# EAGLE design Linefollower_ArduinoNano (EAGLE 9.3.1)
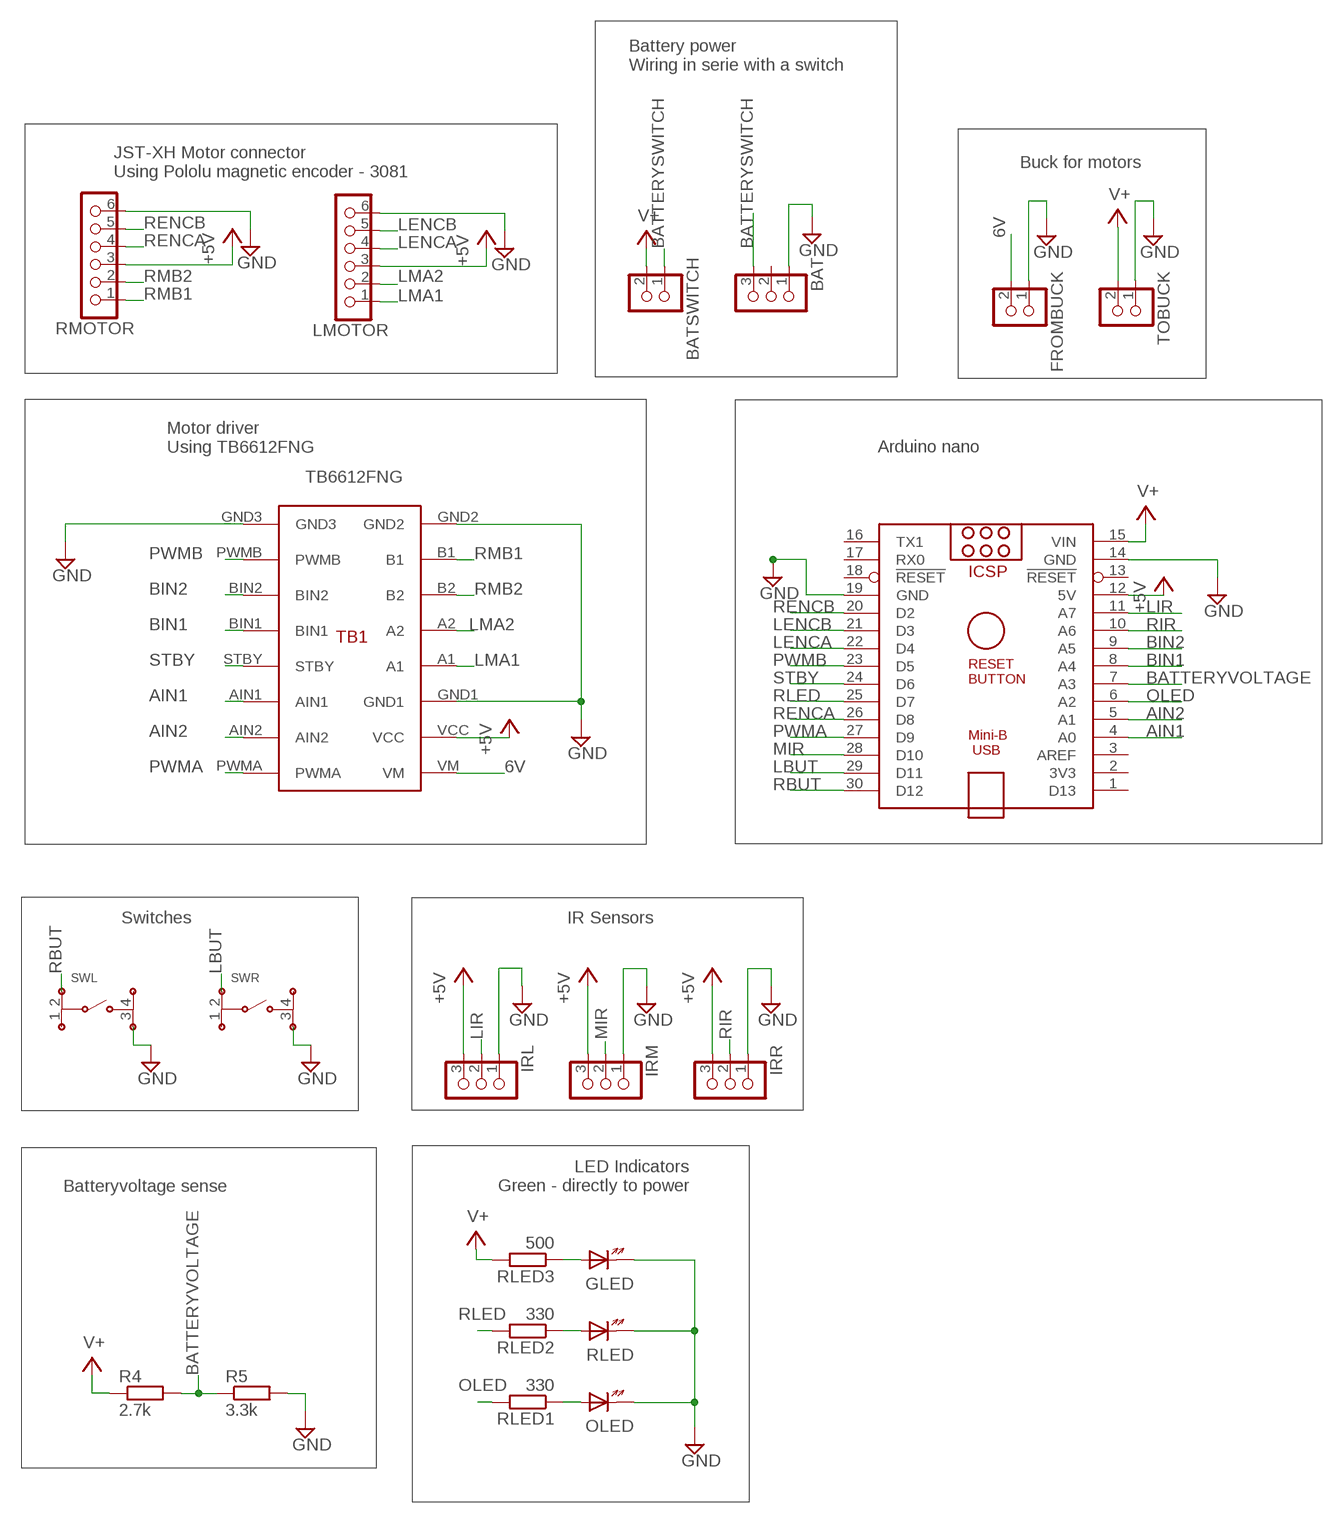
[diagram p0: schematic, sheet 1]

## Parts
ARDUINO_NANO1  ARDUINO_NANO  [ARDUINO_NANO]
BAT  EH_B3B-EH  [B3B-EH]
BATSWITCH  EH_B2B-EH  [B2B-EH]
FROMBUCK  EH_B2B-EH  [B2B-EH]
GLED  LED5MM  [LED5MM]
IRL  EH_B3B-EH  [B3B-EH]
IRM  EH_B3B-EH  [B3B-EH]
IRR  EH_B3B-EH  [B3B-EH]
LMOTOR  EH_B6B-EH  [B6B-EH]
OLED  LED5MM  [LED5MM]
R4  2.7k  R0603  [R0603]
R5  3.3k  R0603  [R0603]
RLED  LED5MM  [LED5MM]
RLED1  330  R0603  [R0603]
RLED2  330  R0603  [R0603]
RLED3  500  R0603  [R0603]
RMOTOR  EH_B6B-EH  [B6B-EH]
SWL  SKHHA/D  [SKHHA/D]
SWR  SKHHA/D  [SKHHA/D]
TB1  TB6612FNG  [TB6612FNG]
TOBUCK  EH_B2B-EH  [B2B-EH]

## Nets
6V [motorPower]: FROMBUCK.2 TB1.VM
+5V [motorPower]: ARDUINO_NANO1.12(5V) IRL.3 IRM.3 IRR.3 LMOTOR.3 RMOTOR.3 TB1.VCC
AIN1: ARDUINO_NANO1.4(A0) TB1.AIN1
AIN2: ARDUINO_NANO1.5(A1) TB1.AIN2
BATTERYSWITCH [motorPower]: BAT.3 BATSWITCH.1
BATTERYVOLTAGE: ARDUINO_NANO1.7(A3) R4.2 R5.1
BIN1: ARDUINO_NANO1.8(A4) TB1.BIN1
BIN2: ARDUINO_NANO1.9(A5) TB1.BIN2
GND [motorPower]: ARDUINO_NANO1.14(GND) ARDUINO_NANO1.19(GND) BAT.1 FROMBUCK.1 GLED.K IRL.1 IRM.1 IRR.1 LMOTOR.6 OLED.K R5.2 RLED.K RMOTOR.6 SWL.3 SWR.3 TB1.GND1 TB1.GND2 TB1.GND3 TOBUCK.1
LBUT: ARDUINO_NANO1.29(D11) SWR.2
LENCA: ARDUINO_NANO1.22(D4) LMOTOR.4
LENCB: ARDUINO_NANO1.21(D3) LMOTOR.5
LIR: ARDUINO_NANO1.11(A7) IRL.2
LMA1 [motorPower]: LMOTOR.1 TB1.A1
LMA2: LMOTOR.2 TB1.A2
MIR: ARDUINO_NANO1.28(D10) IRM.2
N$1: GLED.A RLED3.1
N$2: RLED2.1 RLED.A
N$3: OLED.A RLED1.1
OLED: ARDUINO_NANO1.6(A2) RLED1.2
PWMA: ARDUINO_NANO1.27(D9) TB1.PWMA
PWMB: ARDUINO_NANO1.23(D5) TB1.PWMB
RBUT: ARDUINO_NANO1.30(D12) SWL.2
RENCA: ARDUINO_NANO1.26(D8) RMOTOR.4
RENCB: ARDUINO_NANO1.20(D2) RMOTOR.5
RIR: ARDUINO_NANO1.10(A6) IRR.2
RLED: ARDUINO_NANO1.25(D7) RLED2.2
RMB1 [motorPower]: RMOTOR.1 TB1.B1
RMB2 [motorPower]: RMOTOR.2 TB1.B2
STBY: ARDUINO_NANO1.24(D6) TB1.STBY
V+ [motorPower]: ARDUINO_NANO1.15(VIN) BATSWITCH.2 R4.1 RLED3.2 TOBUCK.2
Unconnected: ARDUINO_NANO1.1(D13) ARDUINO_NANO1.2(3V3) ARDUINO_NANO1.3(AREF) ARDUINO_NANO1.13(!RESET) ARDUINO_NANO1.16(TX1) ARDUINO_NANO1.17(RX0) ARDUINO_NANO1.18(!RESET) BAT.2 SWL.1 SWL.4 SWR.1 SWR.4

## Notes on the sheet
- Battery power
  Wiring in serie with a switch
- Buck for motors
- JST-XH Motor connector
  Using Pololu magnetic encoder - 3081
- Motor driver
  Using TB6612FNG
- Arduino nano
- Switches | IR Sensors
- LED Indicators
  Green - directly to power
- Batteryvoltage sense

## Library data of the parts
ARDUINO_NANO1 = ArduinoNanoV30:ARDUINO_NANO: Arduino Nano V3.0 Overview: The Arduino Nano is a small, complete, and breadboard-friendly board based on the ATmega328 (Arduino Nano 3.x) or ATmega168 (Arduino Nano 2.x). It has more or less the same functionality of the Arduino Duemilanove, but in a different package. It lacks only a DC power jack, and works with a Mini-B USB cable instead of a standard one. The Nano was designed and is being produced by Gravitech. Specifications: Microcontroller Atmel ATmega168 or ATmega328 Operating Voltage (logic level) 5 V Input Voltage (recommended) 7-12 V Input Voltage (limits) 6-20 V Digital I/O Pins 14 (of which 6 provide PWM output) Analog Input Pins 8 DC Current per I/O Pin 40 mA Flash Memory 16 KB (ATmega168) or 32 KB (ATmega328) of which 2 KB used by bootloader SRAM 1 KB (ATmega168) or 2 KB (ATmega328) EEPROM 512 bytes (ATmega168) or 1 KB (ATmega328) Clock Speed 16 MHz Dimensions 0.73" x 1.70" Length 45 mm Width 18 mm Weigth 5 g Power: The Arduino Nano can be powered via the Mini-B USB connection, 6-20V unregulated external power supply (pin 30), or 5V regulated external power supply (pin 27). The power source is automatically selected to the highest voltage source. Memory: The ATmega168 has 16 KB of flash memory for storing code (of which 2 KB is used for the bootloader); the ATmega328 has 32 KB, (also with 2 KB used for the bootloader). The ATmega168 has 1 KB of SRAM and 512 bytes of EEPROM (which can be read and written with the EEPROM library); the ATmega328 has 2 KB of SRAM and 1 KB of EEPROM. Input and Output: Each of the 14 digital pins on the Nano can be used as an input or output, using pinMode(), digitalWrite(), and digitalRead() functions. They operate at 5 volts. Each pin can provide or receive a maximum of 40 mA and has an internal pull-up resistor (disconnected by default) of 20-50 kOhms. In addition, some pins have specialized functions. Visit Arduino - ArduinoBoardNano <https://www.arduino.cc/en/Main/ArduinoBoardNano>
BAT IRL IRM IRR = CASE-JST:EH_B3B-EH: JST EH Connector, through hole, 3 pin, top entry Description: JST EH connector with 2.5 mm pitch, through hole version, 3 pin, top entry. Links: Datasheet <http://www.jst-mfg.com/product/pdf/eng/eEH.pdf>
BATSWITCH FROMBUCK TOBUCK = CASE-JST:EH_B2B-EH: JST EH Connector, through hole, 2 pin, top entry Description: JST EH connector with 2.5 mm pitch, through hole version, 2 pin, top entry. Links: Datasheet <http://www.jst-mfg.com/product/pdf/eng/eEH.pdf>
GLED OLED RLED = CASE-LED:LED5MM: LED 5mm (TH) Description: Standard 5mm TH LED
LMOTOR RMOTOR = CASE-JST:EH_B6B-EH: JST EH Connector, through hole, 6 pin, top entry Description: JST EH connector with 2.5 mm pitch, through hole version, 6 pin, top entry. Links: Datasheet <http://www.jst-mfg.com/product/pdf/eng/eEH.pdf>
R4 R5 RLED1-RLED3 = CASE-RCL:R0603: Standard Chip RESISTOR 0603 (1608 Metric) Description: Standard Chip RESISTOR 0603 (1608 Metric)
SWL SWR = CASE-Switches:SKHHA/D: ALPS SKHHA/D Tactile SPST switches (DIP) Description: ALPS SKHHA/D Tactile SPST switches in DIP package. Links: SKHHAJA010 <http://www.farnell.com/datasheets/1685516.pdf?_ga=2.249631877.2071720333.1546461288-1112771566.1525371275> SKHHARA010 <http://www.farnell.com/datasheets/1685516.pdf?_ga=2.249631877.2071720333.1546461288-1112771566.1525371275> SKHHAPA010 <http://www.farnell.com/datasheets/1582298.pdf?_ga=2.236523650.2071720333.1546461288-1112771566.1525371275> SKHHDUA010 <http://www.farnell.com/datasheets/1582310.pdf?_ga=2.236523650.2071720333.1546461288-1112771566.1525371275>
TB1 = TB6612FNG:TB6612FNG

## Net classes
0 default: width 0.254 mm
1 motorPower: width 0.889 mm, clearance 0.254 mm

## Board
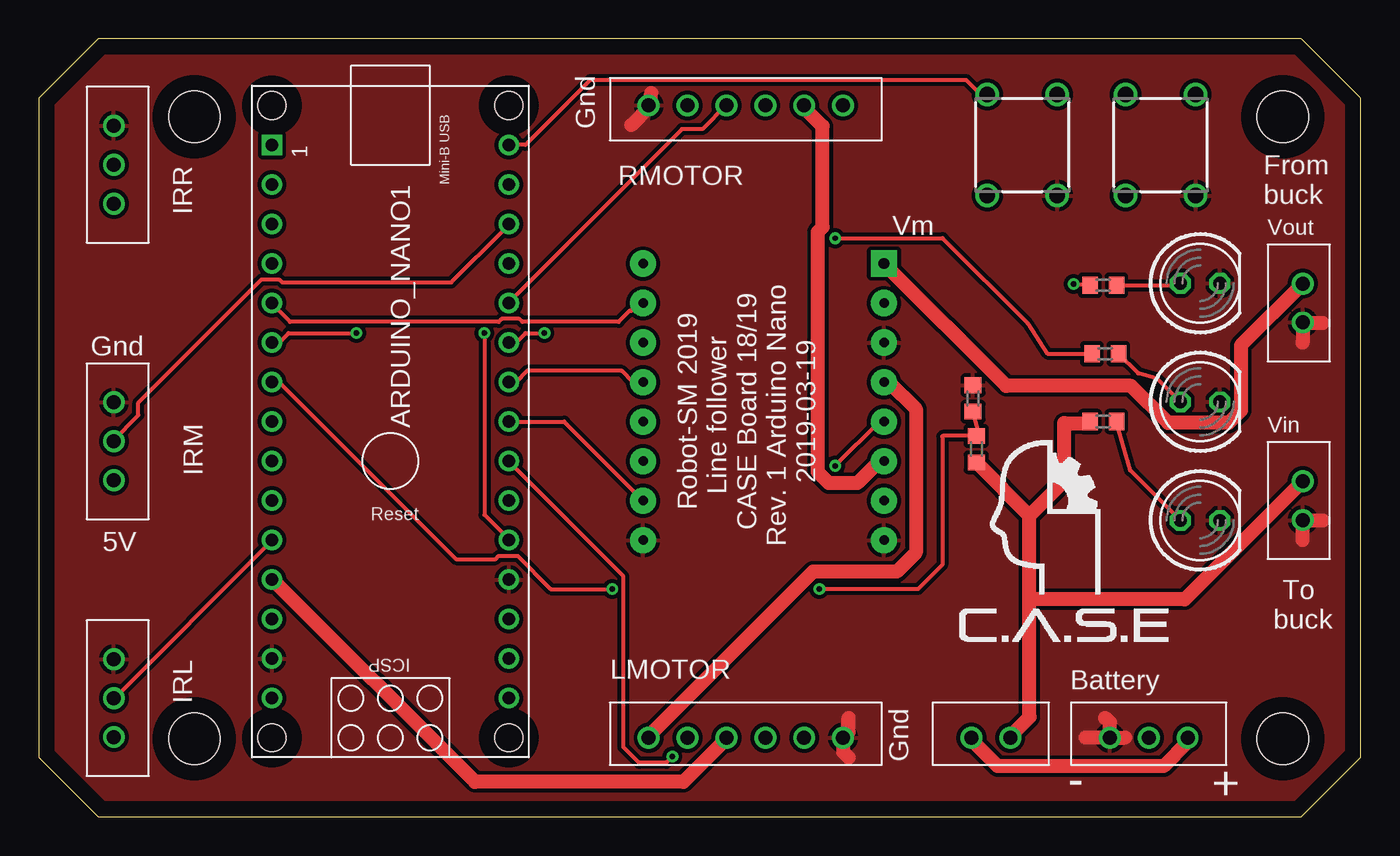
[diagram p1: board, top side]
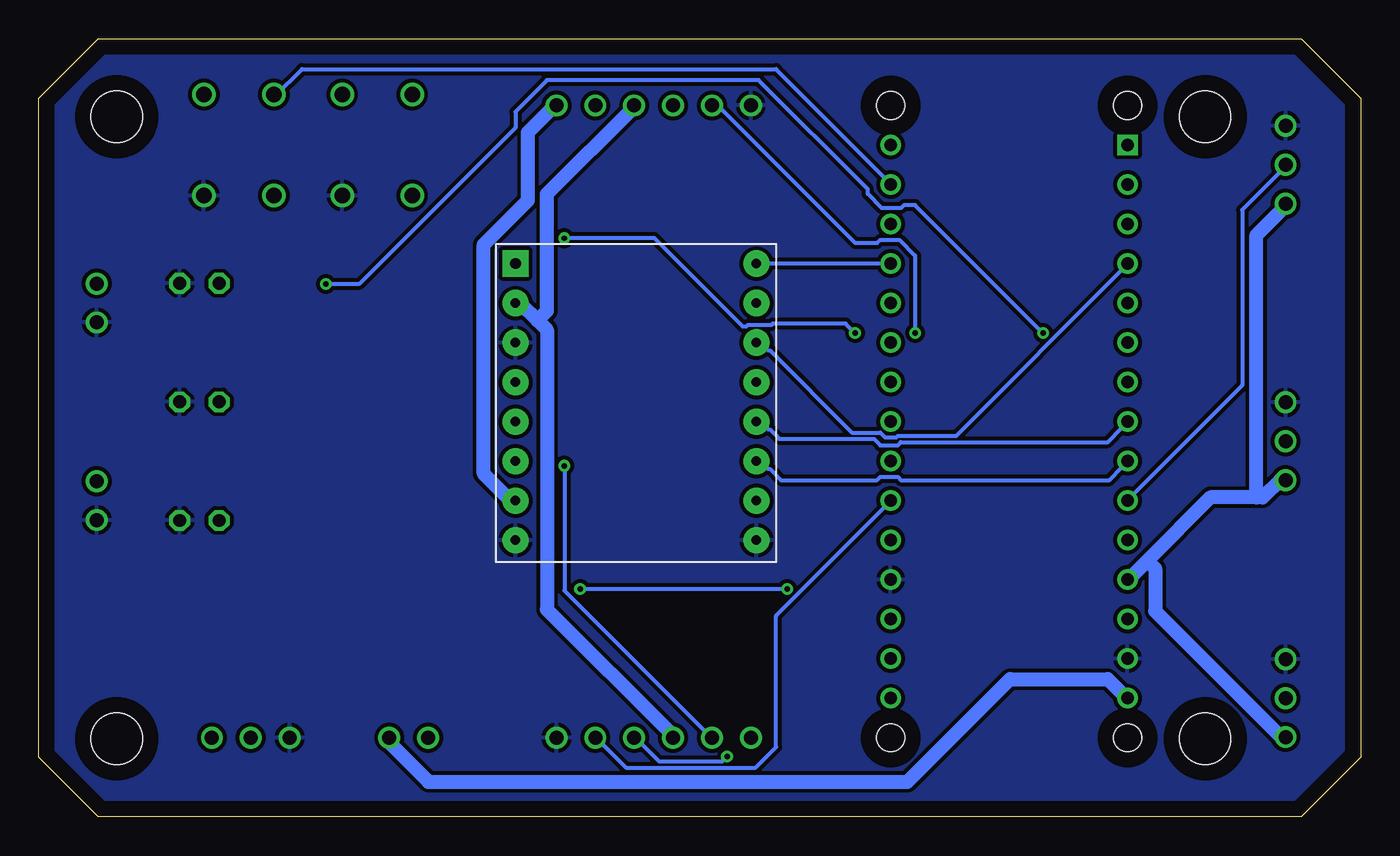
[diagram p2: board, bottom side, seen from below]

Size 85 x 50 mm. Coordinates in mm from the lower left corner, seen from the top.
Outline: 3.81,0 81.19,0 85,3.81 85,46.19 81.19,50 3.81,50 0,46.19 0,3.81 3.81,0
Copper layers (1*16): Top 0.035mm / dielectric 1.5mm / Bottom 0.035mm
Design rules "default": minimum track width 6mil, minimum drill 0.35mm, track to track 6mil, track to pad 6mil, pad to pad 6mil, via to via 6mil, smd to smd 6mil, copper to edge 40mil, drill to drill 6mil, minimum pad ring 10mil, minimum via ring 8mil, stop-mask expansion 4mil, vias tented up to drill 0mil, thermal gap 10mil
Holes 3.3 mm at 10,5 80,45 10,45 80,5

### Footprints (pad centres in the part's own frame; a part is rotated, then mirrored left to right if it is on the bottom)
ARDUINO_NANO = drill 0.8 square: 1 -20.32,-7.62 | drill 0.8: 2 -17.78,-7.62; 3 -15.24,-7.62; 4 -12.7,-7.62; 5 -10.16,-7.62; 6 -7.62,-7.62; 7 -5.08,-7.62; 8 -2.54,-7.62; 9 0,-7.62; 10 2.54,-7.62; 11 5.08,-7.62; 12 7.62,-7.62; 13 10.16,-7.62; 14 12.7,-7.62; 15 15.24,-7.62; 16 15.24,7.62; 17 12.7,7.62; 18 10.16,7.62; 19 7.62,7.62; 20 5.08,7.62; 21 2.54,7.62; 22 0,7.62; 23 -2.54,7.62; 24 -5.08,7.62; 25 -7.62,7.62; 26 -10.16,7.62; 27 -12.7,7.62; 28 -15.24,7.62; 29 -17.78,7.62; 30 -20.32,7.62 | hole 1.778: -22.86,-7.62; -22.86,7.62; 17.78,7.62; 17.78,-7.62
B3B-EH = drill 0.9: 1 -2.5,0; 2 0,0; 3 2.5,0
B2B-EH = drill 0.9: 1 -1.25,0; 2 1.25,0
LED5MM = drill 0.813 octagon: A -1.27,0; K 1.27,0
B6B-EH = drill 0.9: 1 -6.25,0; 2 -3.75,0; 3 -1.25,0; 4 1.25,0; 5 3.75,0; 6 6.25,0
R0603 = smd 1 x 1.1: 1 -0.85,0; 2 0.85,0
SKHHA/D = drill 1 pad 1.5: 1 -2.25,-3.25; 2 -2.25,3.25; 3 2.25,-3.25; 4 2.25,3.25
TB6612FNG = drill 0.6 pad 1.676: A1 -7.62,-1.27; A2 -7.62,-3.81; AIN1 7.874,1.27; AIN2 7.874,3.81; B1 -7.62,-8.89; B2 -7.62,-6.35; BIN1 7.874,-3.81; BIN2 7.874,-6.35; GND1 -7.62,1.27; GND2 -7.62,-11.43; GND3 7.874,-11.43; PWMA 7.874,6.35; PWMB 7.874,-8.89; STBY 7.874,-1.27; VCC -7.62,3.81 | drill 0.7 pad 1.676 square: VM -7.62,6.35

### Placement (x,y rotation side)
ARDUINO_NANO1  22.61,22.86 270 top
BAT  71.37,5.08 0 top
BATSWITCH  61.21,5.08 0 top
FROMBUCK  81.28,33.02 90 top
GLED  74.68,19.05 0 top
IRL  4.83,7.62 270 top
IRM  4.83,24.13 270 top
IRR  4.83,41.91 270 top
LMOTOR  45.47,5.08 0 top
OLED  74.68,34.29 0 top
R4  60.28,23.62 90 top
R5  60.07,26.88 90 top
RLED  74.68,26.67 0 top
RLED1  68.45,34.16 180 top
RLED2  68.58,29.76 180 top
RLED3  68.45,25.4 180 top
RMOTOR  45.47,45.72 180 top
SWL  63.25,43.18 0 top
SWR  72.14,43.18 0 top
TB1  46.74,29.21 0 bottom
TOBUCK  81.28,20.32 90 top

### Tracks (layer width: path | path; a pad name or v marks a point on that pad's centre or on a via)
6V
  Top 0.889: FROMBUCK.2 77.31,30.3 77.31,26.11 76.51,25.31 72.62,25.31 70.24,27.7 62.22,27.7 TB1.VM
+5V
  Top 0.889: ARDUINO_NANO1.12 15.04,15.24 28.04,2.23 41.45,2.23 44.3,5.08 LMOTOR.3
  Bottom 0.889: 13.72,16.46 9.65,20.52 6.71,20.52 | 13.72,16.46 14.94,15.24 ARDUINO_NANO1.12 | 6.71,20.52 6.3,20.52 5.18,21.64 4.88,21.64 IRM.3 | IRL.3 4.88,5.18 5.18,5.18 13.21,13.21 13.21,15.95 13.72,16.46 | 6.71,20.52 6.71,37.39 4.88,39.22 4.88,39.32 IRR.3 | 52.93,31.9 54.05,33.02 TB1.VCC | 52.93,31.9 52.32,31.29 52.32,13.31 44.3,5.28 44.3,5.08 LMOTOR.3 | RMOTOR.3 46.74,45.72 46.74,45.62 52.32,40.03 52.32,32.51 52.93,31.9
AIN1
  Bottom 0.254: TB1.AIN1 38.61,30.48 38.1,29.97 38,29.97 32.72,24.69 30.89,24.69 30.58,24.38 29.87,24.38 29.77,24.49 26.01,24.49 15.34,35.15 15.34,35.26 15.04,35.56 ARDUINO_NANO1.4
AIN2
  Top 0.254: TB1.AIN2 38.61,33.02 38.1,32.51 38,32.51 37.29,31.8 31.09,31.8 30.89,32 29.77,32 29.57,31.8 16.15,31.8 15.34,32.61 15.34,32.72 15.04,33.02 ARDUINO_NANO1.5
BATTERYSWITCH
  Top 0.889: BATSWITCH.1 60.05,5.08 60.05,4.88 61.67,3.25 72.34,3.25 73.86,4.78 BAT.3
BATTERYVOLTAGE  (via drill 0.35)
  Top 0.254: R5.1 60.39,24.91 R4.2 58.13,24.47 58.09,24.43 58.09,16.18 56.54,14.63 v50.19,14.63 | v36.88,14.63 32.92,14.63 30.79,16.76 29.57,16.76 29.36,16.56 26.82,16.56 15.44,27.94 ARDUINO_NANO1.7
  Bottom 0.254: v36.88,14.63 v50.19,14.63
BIN1
  Bottom 0.254: TB1.BIN1 38.61,25.4 38.1,24.89 38,24.89 37.39,24.28 31.29,24.28 30.89,23.88 29.77,23.88 29.57,24.08 16.26,24.08 15.34,24.99 15.34,25.09 15.04,25.4 ARDUINO_NANO1.8
BIN2
  Bottom 0.254: TB1.BIN2 38.61,22.86 38.1,22.35 38,22.35 37.29,21.64 31.09,21.64 30.89,21.84 29.77,21.84 29.57,21.64 16.15,21.64 15.34,22.45 15.34,22.55 15.04,22.86 ARDUINO_NANO1.9
GND
  Top 0.889: 81.28,17.78 TOBUCK.1 81.3,19.05 82.55,19.05 | 81.28,30.48 FROMBUCK.1 81.3,31.75 82.55,31.75 | BAT.1 68.87,6.06 68.58,6.35 | BAT.1 67.31,5.08 | BAT.1 69.85,5.08 | 52.07,6.35 52.07,5.43 LMOTOR.6 51.72,4.16 52.07,3.81 | 38.1,44.45 39.22,45.57 RMOTOR.6 39.37,45.87 39.37,46.52
  pour Top: -2.54,50.8 -2.54,0 1.27,-3.81 82.55,-3.81 88.9,2.54 88.9,46.99 83.82,52.07 81.28,52.07
  pour Bottom: -3.81,0 -3.81,53.34 73.12,60.23 88.9,44.45 88.9,2.54 82.55,-3.81 0,-3.81
LBUT
  Bottom 0.254: ARDUINO_NANO1.29 30.28,40.64 30.58,40.95 30.58,41.05 37.59,48.06 68.07,48.06 69.8,46.33 SWR.2
LENCA  (via drill 0.35)
  Top 0.254: v40.74,3.86 40.34,3.45 38.61,3.45 37.59,4.47 37.59,15.44 30.58,22.45 30.58,22.55 30.28,22.86 ARDUINO_NANO1.22
  Bottom 0.254: v40.74,3.86 41.05,3.56 45.11,3.56 46.63,5.08 LMOTOR.4
LENCB
  Bottom 0.254: ARDUINO_NANO1.21 30.28,20.32 30.58,20.02 30.58,19.91 37.59,12.9 37.59,4.47 38.91,3.15 47.24,3.15 49.17,5.08 LMOTOR.5
LIR
  Top 0.254: ARDUINO_NANO1.11 14.94,17.78 14.63,17.48 14.63,17.37 4.88,7.62 IRL.2
LMA1
  Top 0.889: TB1.A1 54.66,27.94 56.39,26.21 56.39,16.97 55.17,15.75 49.78,15.75 39.22,5.18 LMOTOR.1
LMA2  (via drill 0.35)
  Top 0.254: v51.21,22.55 54.05,25.4 TB1.A2
  Bottom 0.254: v51.21,22.55 51.21,14.53 41.76,5.08 LMOTOR.2
MIR
  Top 0.254: ARDUINO_NANO1.28 30.18,38.1 29.87,37.8 29.87,37.69 26.52,34.34 15.65,34.34 15.44,34.54 14.33,34.54 6.4,26.62 6.4,25.81 4.78,24.18 IRM.2
N$1
  Top 0.254: GLED.A 70.19,22.27 RLED3.1
N$2
  Top 0.254: RLED.A 71.93,28.14 70.7,28.49 RLED2.1
N$3
  Top 0.254: RLED1.1 69.39,34.14 73.41,34.14 OLED.A
OLED  (via drill 0.35)
  Top 0.254: v66.55,34.24 67.56,34.24 RLED1.2 | v20.42,31.09 16.05,31.09 15.44,30.48 ARDUINO_NANO1.6
  Bottom 0.254: v66.55,34.24 64.41,34.24 54.36,44.3 54.36,45.31 52.32,47.35 38.71,47.35 31.7,40.34 31.7,40.03 30.79,39.12 29.57,39.12 29.36,39.32 28.65,39.32 v20.42,31.09
PWMA
  Bottom 0.254: ARDUINO_NANO1.27 TB1.PWMA
PWMB
  Top 0.254: ARDUINO_NANO1.23 33.78,25.4 TB1.PWMB
RBUT
  Top 0.254: ARDUINO_NANO1.30 31.29,43.18 35.46,47.35 59.64,47.35 60.55,46.43 60.96,46.43 SWL.2
RENCA
  Top 0.254: ARDUINO_NANO1.26 30.28,33.02 30.58,33.33 30.58,33.43 41.35,44.2 42.67,44.2 44.2,45.72 RMOTOR.4
RENCB  (via drill 0.35)
  Top 0.254: v28.65,31.09 28.65,19.41 29.87,18.19 29.87,18.09 30.18,17.78 ARDUINO_NANO1.20
  Bottom 0.254: v28.65,31.09 28.65,36.07 29.67,37.08 30.89,37.08 31.09,36.88 32.51,36.88 41.35,45.72 RMOTOR.5
RIR
  Bottom 0.254: ARDUINO_NANO1.10 14.94,20.32 14.63,20.62 14.63,20.73 7.62,27.74 7.62,39.01 4.78,41.86 IRR.2
RLED  (via drill 0.35)
  Top 0.254: v51.21,37.19 58.12,37.19 63.6,31.7 64.86,29.76 RLED2.2 | v32.51,31.09 31.29,31.09 30.68,30.48 ARDUINO_NANO1.25
  Bottom 0.254: v51.21,37.19 45.41,37.19 39.73,31.5 39.52,31.5 39.42,31.6 37.9,31.6 37.8,31.7 33.12,31.7 v32.51,31.09
RMB1
  Bottom 0.889: TB1.B1 54.66,20.32 56.39,22.05 56.39,36.78 53.54,39.62 53.54,43.99 51.82,45.72 RMOTOR.1
RMB2
  Top 0.889: TB1.B2 54.05,22.86 52.63,21.44 50.8,21.44 50.09,22.15 50.09,37.59 50.39,37.9 50.39,44.4 49.28,45.52 49.28,45.72 RMOTOR.2
STBY
  Top 0.254: ARDUINO_NANO1.24 30.68,27.94 31.39,28.65 37.49,28.65 38.2,27.94 TB1.STBY
V+
  Top 0.889: 63.7,13.97 63.7,6.4 62.38,5.08 BATSWITCH.2 | 63.7,13.97 63.7,19.35 | R4.1 63.7,19.35 | 63.7,19.35 65.94,21.59 65.94,25.3 67.5,25.3 RLED3.2 | TOBUCK.2 73.68,13.97 63.7,13.97
  Bottom 0.889: ARDUINO_NANO1.15 15.04,7.62 16.26,8.84 22.55,8.84 29.16,2.23 59.94,2.23 62.48,4.78 62.48,5.08 BATSWITCH.2

### Text on the board
tNames: Gnd | From / buck | Vm | Vout | Gnd | Robot-SM 2019 / Line follower / CASE Board 18/19 / Rev. 1 Arduino Nano / 2019-03-19 | Vin | 5V | To / buck | Battery | Gnd | - | +